# Altium schematic sheet tx.SchDoc: Transmitter
size Letter; CheckedBy: J. Brinton; CompanyName: Signal Laboratories, Inc.; DrawnBy: J. Brinton; Engineer: J. Brinton; Address1: 3479 Edison Way; Address2: Menlo Park CA 94025; Address3: +1 (877) 778-8435; Address4: siglabs.com; Revision: 3; SheetNumber: 4; SheetTotal: 49
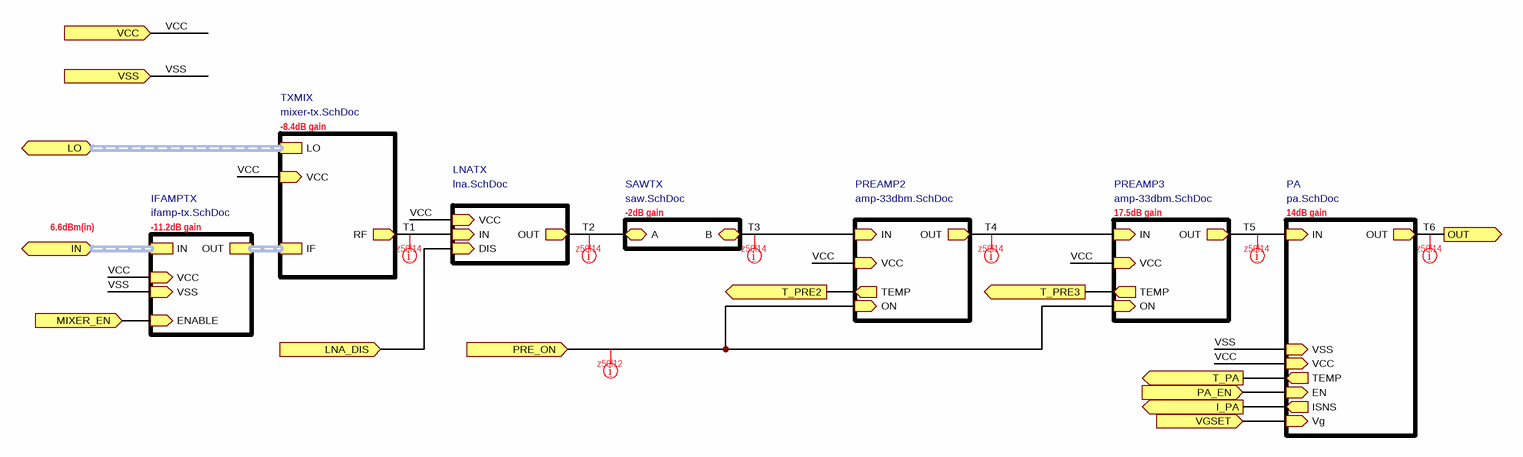
[diagram p0: tx.SchDoc]

## Sub-sheets
IFAMPTX = ifamp-tx.SchDoc: IN (harness DIFF100), OUT (harness DIFF100), ENABLE (in), VCC (in), VSS (in)
LNATX = lna.SchDoc: IN (in), OUT (out), VCC (in), DIS (in)
PA = pa.SchDoc: IN (in), OUT (out), Vg (in), EN (in), TEMP (out), VCC (in), ISNS (out), VSS (in)
PREAMP2 = amp-33dbm.SchDoc: IN (in), OUT (out), ON (in), TEMP (out), VCC (in)
PREAMP3 = amp-33dbm.SchDoc: IN (in), OUT (out), ON (in), TEMP (out), VCC (in)
SAWTX = saw.SchDoc: A (bidir), B (bidir)
TXMIX = mixer-tx.SchDoc: LO (harness CLK-LVDS), RF (out), IF (harness DIFF100), VCC (in)

## Ports
I_PA (out), IN (harness DIFF100), LNA_DIS (in), LO (harness CLK-LVDS), MIXER_EN (in), OUT (out), PA_EN (in), PRE_ON (in), T_PA (out), T_PRE2 (out), T_PRE3 (out), VCC (in), VGSET (in), VSS (in)

## Nets
I_PA: port I_PA, sheet PA/ISNS
LNA_DIS: port LNA_DIS, sheet LNATX/DIS
MIXER_EN: port MIXER_EN, sheet IFAMPTX/ENABLE
PA_EN: port PA_EN, sheet PA/EN
PRE_ON: port PRE_ON, sheet PREAMP3/ON, sheet PREAMP2/ON
T1: sheet TXMIX/RF, sheet LNATX/IN
T2: sheet SAWTX/A, sheet LNATX/OUT
T3: sheet SAWTX/B, sheet PREAMP2/IN
T4: sheet PREAMP3/IN, sheet PREAMP2/OUT
T5: sheet PREAMP3/OUT, sheet PA/IN
T6: port OUT, sheet PA/OUT
T_PA: port T_PA, sheet PA/TEMP
T_PRE2: port T_PRE2, sheet PREAMP2/TEMP
T_PRE3: port T_PRE3, sheet PREAMP3/TEMP
VCC: port VCC, sheet TXMIX/VCC, sheet PREAMP3/VCC, sheet PA/VCC, sheet IFAMPTX/VCC, sheet PREAMP2/VCC, sheet LNATX/VCC
VGSET: port VGSET, sheet PA/Vg
VSS: port VSS, sheet PA/VSS, sheet IFAMPTX/VSS

## Buses and harness runs
harness port IN = sheet IFAMPTX/IN
harness port LO = sheet TXMIX/LO
harness sheet IFAMPTX/OUT = sheet TXMIX/IF

## Layout directives
net class z50l14: T1, T2, T3, T4, T5, T6
net class z50l12: PRE_ON

## Notes on the sheet
- -8.4dB gain
- 6.6dBm(in)
- -11.2dB gain
- -2dB gain
- 17.5dB gain
- 14dB gain
- Title
- Engineer
- Revision
- Drawn By
- Checked By
- Date
- Sheet
- of